# Altium project Control_Board.PrjPcb
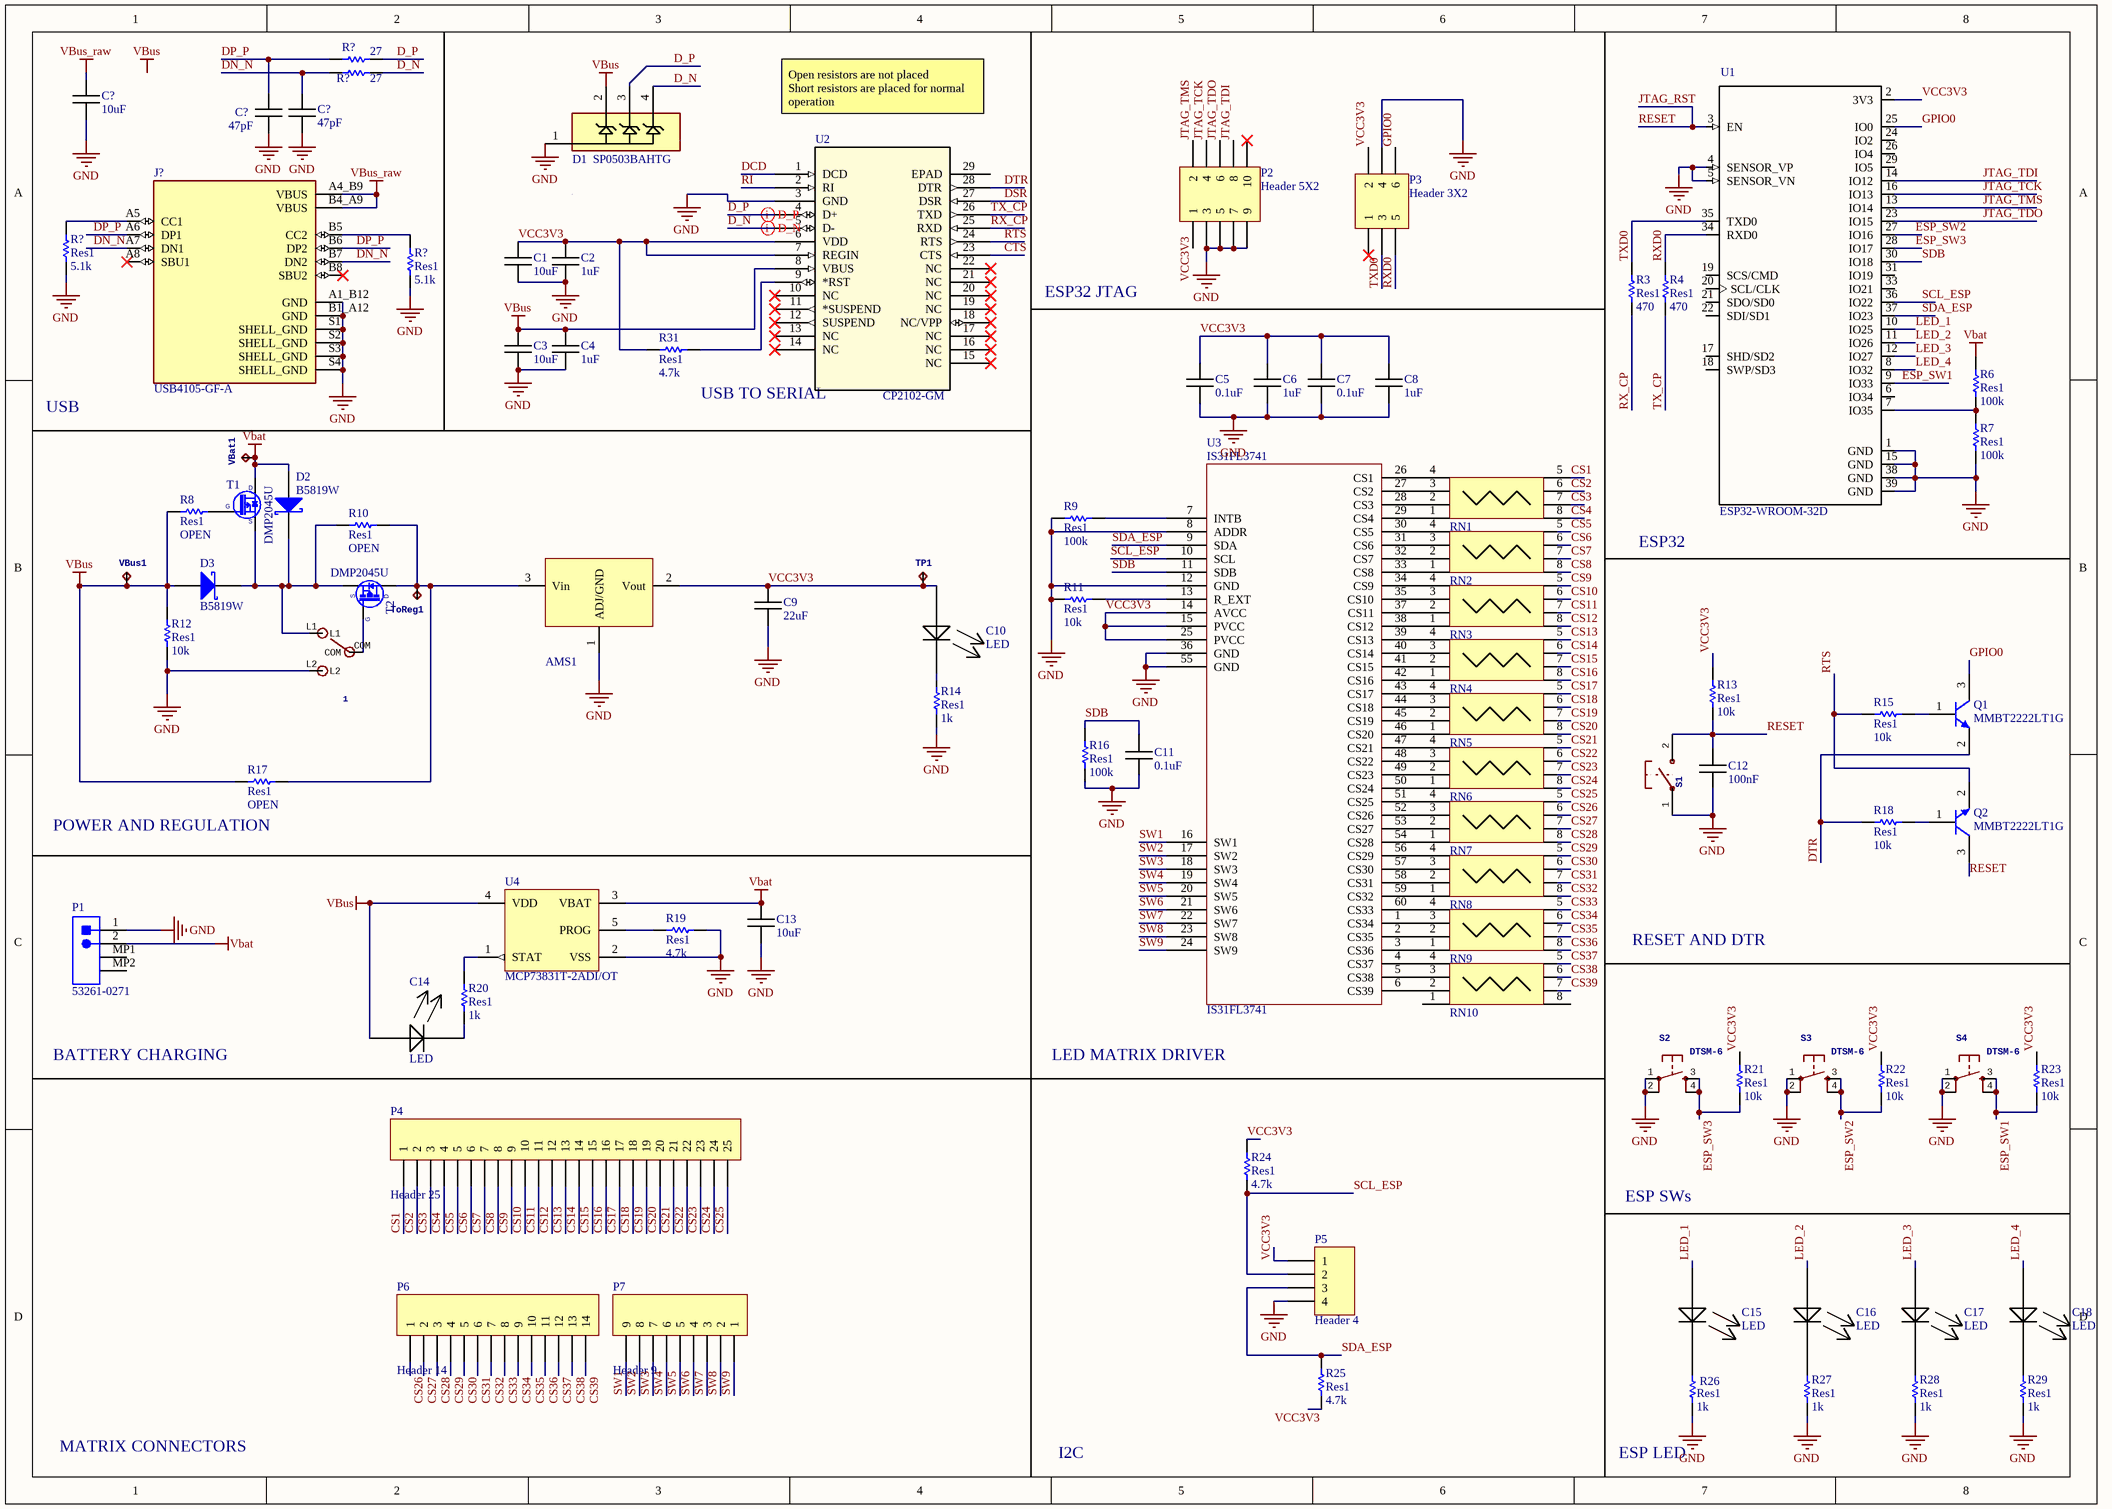
[diagram p0: Sheet2.SchDoc]
1 sheet, 91 parts. Net scope: global (net labels, ports and power ports of the same name join across sheets).
Board files: Control_Board.PcbDoc, PCB2.PcbDoc

## Sheet Sheet2.SchDoc
size A3

### Parts
(Parts that share a designator on the sheet are numbered #1, #2 ... from top to bottom, then left to right.)
1  Footprint of the VIMEX MSK-12C02 SPDT SMD Switch Created by mzst on 17-Jan-2016  [MSK-12C02]  (value not drawn)
AMS1  AMS1117  [SOT-223-3]  (value not drawn)
C1  10uF  [C 0603 / 1608]
C2  1uF  [C 0603 / 1608]
C3  10uF  [C 0603 / 1608]
C4  1uF  [C 0603 / 1608]
C5  0.1uF  [C 0603 / 1608]
C6  1uF  [C 0603 / 1608]
C7  0.1uF  [C 0603 / 1608]
C8  1uF  [C 0603 / 1608]
C9  22uF  [C 0603 / 1608]
C10  LED  [LED 0603(2)]
C11  0.1uF  [C 0603 / 1608]
C12  100nF  [C 0603 / 1608]
C13  10uF  [C 0603 / 1608]
C14  LED  [LED 0603(2)]
C15  LED  [LED 0603(2)]
C16  LED  [LED 0603(2)]
C17  LED  [LED 0603(2)]
C18  LED  [LED 0603(2)]
C?#1  10uF  [C 0603 / 1608]
C?#2  47pF  [C 0603 / 1608]
C?#3  47pF  [C 0603 / 1608]
D1  Part Number: SP0503BAHTG  [Littelfuse_SP0503BAHTG_0]  (hidden comment: Diode_Littelfuse_SP0503BAHTG_eec)
D2  B5819W  [MCC-SOD123_V]
D3  B5819W  [MCC-SOD123_V]
J?  USB4105-GF-A  [GCT_USB4105-GF-A]
P1  53261-0271  [MOLX-53261-0271_V]
P2  Header 5X2  [5x2_SidePCB]
P3  Header 3X2  [3x2_SidePCB]
P4  Header 25  [HDR1X25]
P5  Header 4  [HDR1X4]
P6  Header 14  [HDR1X14]
P7  Header 9  [HDR1X9]
Q1  MMBT2222LT1G  [ONSC-SOT-23-3-318-08_M]
Q2  MMBT2222LT1G  [ONSC-SOT-23-3-318-08_M]
R3  Res1  value 470  [C 0603 / 1608]
R4  Res1  value 470  [C 0603 / 1608]
R6  Res1  value 100k  [C 0603 / 1608]
R7  Res1  value 100k  [C 0603 / 1608]
R8  Res1  value OPEN  [C 0603 / 1608]
R9  Res1  value 100k  [C 0603 / 1608]
R10  Res1  value OPEN  [C 0603 / 1608]
R11  Res1  value 10k  [C 0603 / 1608]
R12  Res1  value 10k  [C 0603 / 1608]
R13  Res1  value 10k  [C 0603 / 1608]
R14  Res1  value 1k  [C 0603 / 1608]
R15  Res1  value 10k  [C 0603 / 1608]
R16  Res1  value 100k  [C 0603 / 1608]
R17  Res1  value OPEN  [C 0603 / 1608]
R18  Res1  value 10k  [C 0603 / 1608]
R19  Res1  value 4.7k  [C 0603 / 1608]
R20  Res1  value 1k  [C 0603 / 1608]
R21  Res1  value 10k  [C 0603 / 1608]
R22  Res1  value 10k  [C 0603 / 1608]
R23  Res1  value 10k  [C 0603 / 1608]
R24  Res1  value 4.7k  [C 0603 / 1608]
R25  Res1  value 4.7k  [C 0603 / 1608]
R26  Res1  value 1k  [C 0603 / 1608]
R27  Res1  value 1k  [C 0603 / 1608]
R28  Res1  value 1k  [C 0603 / 1608]
R29  Res1  value 1k  [C 0603 / 1608]
R31  Res1  value 4.7k  [C 0603 / 1608]
R?#1  value 27  [C 0603 / 1608]  (hidden comment: Res1)
R?#2  value 27  [C 0603 / 1608]  (hidden comment: Res1)
R?#3  Res1  value 5.1k  [C 0603 / 1608]
R?#4  Res1  value 5.1k  [C 0603 / 1608]
RN1  742C083121JP  [RESARRAY(4x0603)]  (value not drawn)
RN2  742C083121JP  [RESARRAY(4x0603)]  (value not drawn)
RN3  742C083121JP  [RESARRAY(4x0603)]  (value not drawn)
RN4  742C083121JP  [RESARRAY(4x0603)]  (value not drawn)
RN5  742C083121JP  [RESARRAY(4x0603)]  (value not drawn)
RN6  742C083121JP  [RESARRAY(4x0603)]  (value not drawn)
RN7  742C083121JP  [RESARRAY(4x0603)]  (value not drawn)
RN8  742C083121JP  [RESARRAY(4x0603)]  (value not drawn)
RN9  742C083121JP  [RESARRAY(4x0603)]  (value not drawn)
RN10  742C083121JP  [RESARRAY(4x0603)]  (value not drawn)
S1  Switch  [PUSH_SMD_3x4]  (value not drawn)
S2  DTSM-6  [DTSM-6]
S3  DTSM-6  [DTSM-6]
S4  DTSM-6  [DTSM-6]
T1  DMP2045U  [SOT95P237X112-3N]
T2  DMP2045U  [SOT95P237X112-3N]
ToReg1  Test pad  [TP20R]  (value not drawn)
TP1  Test pad  [TP20R]  (value not drawn)
U1  ESP32-WROOM-32D  [MODULE_ESP32-WROOM-32D]
U2  CP2102-GM  [QFN28_5X5]
U3  IS31FL3741  [QFN40P700X700X80-61N]
U4  MCP73831T-2ADI/OT  [SOT-23-OT5_M]
VBat1  Test pad  [TP20R]  (value not drawn)
VBus1  Test pad  [TP20R]  (value not drawn)

### Nets
GND: 1.L2 AMS1.1(ADJ/GND) C1.1 C2.1 C3.1 C4.1 C5.1 C6.1 C7.1 C8.1 C9.1 C11.2 C12.2 C13.1 C?#1.1 C?#2.1 C?#3.1 D1.1(COMMON_ANODE) J?.A1_B12(GND) J?.B1_A12(GND) J?.S1(SHELL_GND) J?.S2(SHELL_GND) J?.S3(SHELL_GND) J?.S4(SHELL_GND) P1.1 P2.3 P2.5 P2.7 P2.9 P3.4 P5.4 R7.1 R9.1 R11.1 R12.2 R14.2 R16.1 R19.1 R26.2 R27.2 R28.2 R29.2 R?#3.1 R?#4.1 S1.1(P$1) S2.1 S2.2 S3.1 S3.2 S4.1 S4.2 U1.1(GND) U1.4(SENSOR_VP) U1.5(SENSOR_VN) U1.15(GND) U1.38(GND) U1.39(GND) U2.3(GND) U3.8(ADDR) U3.12(GND) U3.36(GND) U3.55(GND) U4.2(VSS)
Vbat: C13.2 D2.1(A) P1.2 R6.2 T1.3(D) U4.3(VBAT) VBat1.TP
VBus: C3.2 C4.2 C14.1(+) D1.2(1_CATHODE) D3.1(A) R8.1 R12.1 R17.1 U2.8(VBUS) U4.4(VDD) VBus1.TP
VBus_raw: C?#1.2 J?.A4_B9(VBUS) J?.B4_A9(VBUS)
CS1: P4.1 RN1.5
CS2: P4.2 RN1.6
CS3: P4.3 RN1.7
CS4: P4.4 RN1.8
CS5: P4.5 RN2.5
CS6: P4.6 RN2.6
CS7: P4.7 RN2.7
CS8: P4.8 RN2.8
CS9: P4.9 RN3.5
CS10: P4.10 RN3.6
CS11: P4.11 RN3.7
CS12: P4.12 RN3.8
CS13: P4.13 RN4.5
CS14: P4.14 RN4.6
CS15: P4.15 RN4.7
CS16: P4.16 RN4.8
CS17: P4.17 RN5.5
CS18: P4.18 RN5.6
CS19: P4.19 RN5.7
CS20: P4.20 RN5.8
CS21: P4.21 RN6.5
CS22: P4.22 RN6.6
CS23: P4.23 RN6.7
CS24: P4.24 RN6.8
CS25: P4.25 RN7.5
CS26: P6.1 RN7.6
CS27: P6.2 RN7.7
CS28: P6.3 RN7.8
CS29: P6.4 RN8.5
CS30: P6.5 RN8.6
CS31: P6.6 RN8.7
CS32: P6.7 RN8.8
CS33: P6.8 RN9.5
CS34: P6.9 RN9.6
CS35: P6.10 RN9.7
CS36: P6.11 RN9.8
CS37: P6.12 RN10.5
CS38: P6.13 RN10.6
CS39: P6.14 RN10.7
CTS: U2.23(CTS)
D_N: D1.4(3_CATHODE) R?#2.1 U2.5(D-)
D_P: D1.3(2_CATHODE) R?#1.1 U2.4(D+)
DCD: U2.1(DCD)
DN_N: C?#3.2 J?.A7(DN1) J?.B7(DN2) R?#2.2
DP_P: C?#2.2 J?.A6(DP1) J?.B6(DP2) R?#1.2
DSR: U2.27(DSR)
DTR: Q1.2(E) R18.1 U2.28(DTR)
ESP_SW1: R23.1 S4.3 S4.4 U1.9(IO33)
ESP_SW2: R22.1 S3.3 S3.4 U1.27(IO16)
ESP_SW3: R21.1 S2.3 S2.4 U1.28(IO17)
GPIO0: P3.6 Q1.3(C) U1.25(IO0)
JTAG_RST: C12.1 Q2.3(C) R13.2 S1.2(P$2) U1.3(EN)  [also labelled RESET]
JTAG_TCK: P2.4 U1.16(IO13)
JTAG_TDI: P2.8 U1.14(IO12)
JTAG_TDO: P2.6 U1.23(IO15)
JTAG_TMS: P2.2 U1.13(IO14)
LED_1: C15.1(+) U1.10(IO25)
LED_2: C16.1(+) U1.11(IO26)
LED_3: C17.1(+) U1.12(IO27)
LED_4: C18.1(+) U1.8(IO32)
RI: U2.2(RI)
RTS: Q2.2(E) R15.1 U2.24(RTS)
RX_CP: R3.1 U2.25(RXD)
RXD0: P3.5 R4.2 U1.34(RXD0)
SCL_ESP: P5.2 R24.2 U1.36(IO22) U3.10(SCL)
SDA_ESP: P5.3 R25.2 U1.37(IO23) U3.9(SDA)
SDB: C11.1 R16.2 U1.30(IO18) U3.11(SDB)
SW1: P7.9 U3.16(SW1)
SW2: P7.8 U3.17(SW2)
SW3: P7.7 U3.18(SW3)
SW4: P7.6 U3.19(SW4)
SW5: P7.5 U3.20(SW5)
SW6: P7.4 U3.21(SW6)
SW7: P7.3 U3.22(SW7)
SW8: P7.2 U3.23(SW8)
SW9: P7.1 U3.24(SW9)
TX_CP: R4.1 U2.26(TXD)
TXD0: P3.3 R3.2 U1.35(TXD0)
VCC3V3: AMS1.2(Vout) C1.2 C2.2 C5.2 C6.2 C7.2 C8.2 C9.2 C10.1(+) P3.2 P5.1 R13.1 R21.2 R22.2 R23.2 R24.1 R25.1 R31.1 TP1.TP U1.2(3V3) U2.6(VDD) U2.7(REGIN) U3.14(AVCC) U3.15(PVCC) U3.25(PVCC)
Net1_COM: 1.COM T2.1(G)
Net1_L1: 1.L1 D2.2(K) D3.2(K) R10.1 T1.2(S) T2.2(S)
NetAMS1_3: AMS1.3(Vin) R10.2 R17.2 T2.3(D) ToReg1.TP
NetC10_2: C10.2(-) R14.1
NetC14_2: C14.2(-) R20.2
NetC15_2: C15.2(-) R26.1
NetC16_2: C16.2(-) R27.1
NetC17_2: C17.2(-) R28.1
NetC18_2: C18.2(-) R29.1
NetJ?_A5: J?.A5(CC1) R?#3.2
NetJ?_B5: J?.B5(CC2) R?#4.2
NetQ1_1: Q1.1(B) R15.2
NetQ2_1: Q2.1(B) R18.2
NetR6_1: R6.1 R7.2 U1.7(IO35)
NetR8_2: R8.2 T1.1(G)
NetR9_2: R9.2 U3.7(INTB)
NetR11_2: R11.2 U3.13(R_EXT)
NetR19_2: R19.2 U4.5(PROG)
NetR20_1: R20.1 U4.1(STAT)
NetR31_2: R31.2 U2.9(*RST)
NetRN1_1: RN1.1 U3.29(CS4)
NetRN1_2: RN1.2 U3.28(CS3)
NetRN1_3: RN1.3 U3.27(CS2)
NetRN1_4: RN1.4 U3.26(CS1)
NetRN2_1: RN2.1 U3.33(CS8)
NetRN2_2: RN2.2 U3.32(CS7)
NetRN2_3: RN2.3 U3.31(CS6)
NetRN2_4: RN2.4 U3.30(CS5)
NetRN3_1: RN3.1 U3.38(CS12)
NetRN3_2: RN3.2 U3.37(CS11)
NetRN3_3: RN3.3 U3.35(CS10)
NetRN3_4: RN3.4 U3.34(CS9)
NetRN4_1: RN4.1 U3.42(CS16)
NetRN4_2: RN4.2 U3.41(CS15)
NetRN4_3: RN4.3 U3.40(CS14)
NetRN4_4: RN4.4 U3.39(CS13)
NetRN5_1: RN5.1 U3.46(CS20)
NetRN5_2: RN5.2 U3.45(CS19)
NetRN5_3: RN5.3 U3.44(CS18)
NetRN5_4: RN5.4 U3.43(CS17)
NetRN6_1: RN6.1 U3.50(CS24)
NetRN6_2: RN6.2 U3.49(CS23)
NetRN6_3: RN6.3 U3.48(CS22)
NetRN6_4: RN6.4 U3.47(CS21)
NetRN7_1: RN7.1 U3.54(CS28)
NetRN7_2: RN7.2 U3.53(CS27)
NetRN7_3: RN7.3 U3.52(CS26)
NetRN7_4: RN7.4 U3.51(CS25)
NetRN8_1: RN8.1 U3.59(CS32)
NetRN8_2: RN8.2 U3.58(CS31)
NetRN8_3: RN8.3 U3.57(CS30)
NetRN8_4: RN8.4 U3.56(CS29)
NetRN9_1: RN9.1 U3.3(CS36)
NetRN9_2: RN9.2 U3.2(CS35)
NetRN9_3: RN9.3 U3.1(CS34)
NetRN9_4: RN9.4 U3.60(CS33)
NetRN10_2: RN10.2 U3.6(CS39)
NetRN10_3: RN10.3 U3.5(CS38)
NetRN10_4: RN10.4 U3.4(CS37)

Not connected (* = marked no-connect by the designer): J? A8(SBU1)* B8(SBU2)*; P1 MP1 MP2; P2 1 10*; P3 1*; RN10 1 8; U1 6(IO34) 17(SHD/SD2) 18(SWP/SD3) 19(SCS/CMD) 20(SCL/CLK) 21(SDO/SD0) 22(SDI/SD1) 24(IO2) 26(IO4) 29(IO5) 31(IO19) 33(IO21); U2 10(NC)* 11(*SUSPEND)* 12(SUSPEND)* 13(NC)* 14(NC)* 15(NC)* 16(NC)* 17(NC)* 18(NC/VPP)* 19(NC)* 20(NC)* 21(NC)* 22(NC)* 29(EPAD)

### Layout directives
differential pair: D_N, D_P

### Notes on the sheet
- Open resistors are not placed
  Short resistors are placed for normal operation
- ESP32 JTAG
- USB
- (near U2) USB TO SERIAL
- ESP32
- (near R17) POWER AND REGULATION
- RESET AND DTR
- BATTERY CHARGING
- LED MATRIX DRIVER
- ESP SWs
- MATRIX CONNECTORS
- I2C
- (near R26) ESP LED
- Labels drawn without touching a wire or pin: VBus, VCC3V3

### Library data of the parts
1 = MSK-12C02_SMD_SPDT_SWITCH
AMS1 = AMS1117: LDO 3.3V/5V/12V
C1-C9 C11-C13 C?#1-C?#3 = Capacitor
D1 = Diode_Littelfuse_SP0503BAHTG_eec: DIODE TVS DIODE 5.5VWM 8.5VC SOT143; helpURL: https://upverter.com/upn/revision/6b5b591e3bf31c16/; ComponentLink2Description: Datasheet; Temperature: -40°C to +85°C; Package: SOT143-4; Supplier 2: Mouser; Price: 0.571399033067; Supplier 1: Digi-Key; ComponentLink1URL: https://upverter.com/upn/revision/6b5b591e3bf31c16/; Supplier Part Number 2: 576-SP0503BAHTG; Supplier Part Number 1: F2715CT-ND; Manufacturer: Littelfuse; ComponentLink1Description: Upverter; ComponentLink2URL: http://www.littelfuse.com/~/media/electronics/datasheets/tvs_diode_arrays/littelfuse_tvs_diode_array_sp05_datasheet.pdf.pdf; RoHS: TRUE; Mouser Part Number: 576-SP0503BAHTG; Temperature Range High: +85°C; Digikey Description: DIODE TVS DIODE 5.5VWM 8.5VC SOT143; Digikey Part Number: F2715CT-ND; Lead Free: yes; Temperature Range Low: -40°C
D2 D3 = CMP-2100-03587-1: Schottky Barrier Rectifier, 1 A, 40 Vrm, -65 to 125 degC, 2-Pin SOD123, RoHS, Tape and Reel; Manufacturer: Micro Commercial Components; Package Description: 2-Pin Small Outline Diode, Body 2.7 x 1.6 mm, Height 1.35 mm; Datasheet URL: http://www.mccsemi.com/up_pdf/B5817W-B5819W(SOD-123).pdf; Manufacturer URL: http://www.mccsemi.com/; Package Reference: SOD123; Package URL: http://www.mccsemi.com/up_pdf/1N4448W(SOD-123).pdf; Datasheet Version: Rev. B, 01/2013
J? = USB4105-GF-A: USB-C (USB TYPE-C) USB 2.0 Receptacle Connector 24 (16+8 Dummy) Position Surface Mount, Right Angle; Through Hole; MF: GCT; Price: None; Value: *; MP: USB4105-GF-A; Package: None; Purchase-URL: https://pricing.snapeda.com/search/part/USB4105-GF-A/?ref=eda; SnapEDA_Link: https://www.snapeda.com/parts/USB4105-GF-A/Global%20Connector%20Technology/view-part/4423780/?ref=snap; Check_prices: https://www.snapeda.com/parts/USB4105-GF-A/Global%20Connector%20Technology/view-part/4423780/?ref=eda; Availability: Warning
P1 = CMP-2000-05633-1: PicoBlade(TM) Header, Right Angle, -40 to 85 degC, 2-Pin SMD, RoHS, Tape and Reel; Current - Max: 1A; Brand: Molex; Voltage Rating: 125V; Number of Positions: 2; Pitch: 1.25mm; Package Version: Rev. H, 11/2014; Factory Pack Quantity: 1000; Datasheet URL: http://www.molex.com/webdocs/datasheets/pdf/en-us/0532610271_PCB_HEADERS.pdf; Datasheet Version: 03/2016; Housing Material: Thermoplastic; RoHS: Details; Product Type: Headers; Number of Rows: 1; Termination Style: SMD; Mounting Technology: SurfaceMount; Number of Positions / Contacts: 2; Package URL: http://www.molex.com/pdm_docs/sd/532610271_sd.pdf; Mounting Angle: Right; Mounting Style: SMD/SMT; Manufacturer: Molex; Product Category: 1.25mmConnectors; Tradename: PicoBlade; Voltage - Max: 125V; Manufacturer URL: http://www.molex.com/; Series: 53261; Package Description: 2-Leads Header, Pitch 1.25 mm, Mated Height 3.4 mm; Package Reference: 53261-0271; Current Rating: 1A; Contact Plating: Tin; Contact Material: PhosphorBronze; Type: Shrouded; Packaging: Reel
P2 = Header 5X2: Header, 5-Pin, Dual row; LatestRevisionDate: 17-Jul-2002; LatestRevisionNote: Re-released for DXP Platform.; Publisher: Altium Limited
P3 = Header 3X2: Header, 3-Pin, Dual row; LatestRevisionDate: 17-Jul-2002; LatestRevisionNote: Re-released for DXP Platform.; Publisher: Altium Limited
P4 = Header 25: Header, 25-Pin; LatestRevisionDate: 17-Jul-2002; LatestRevisionNote: Re-released for DXP Platform.; Publisher: Altium Limited
P5 = Header 4: Header, 4-Pin; LatestRevisionDate: 17-Jul-2002; LatestRevisionNote: Re-released for DXP Platform.; Publisher: Altium Limited
P6 = Header 14: Header, 14-Pin; LatestRevisionDate: 17-Jul-2002; LatestRevisionNote: Re-released for DXP Platform.; Publisher: Altium Limited
P7 = Header 9: Header, 9-Pin; LatestRevisionDate: 17-Jul-2002; LatestRevisionNote: Re-released for DXP Platform.; Publisher: Altium Limited
Q1 Q2 = CMP-0722-00001-1: General Purpose Transistor, NPN, 0.6 A IC Continuous, 3-Pin SOT23, RoHS, Tape and Reel; Manufacturer: ON Semiconductor; PTM Max.: 0.225 W; HFE Max.: 300; HFE Min.: 100; V(BR) CEO: 30 V Min.; FT: 250 MHz; IC Continuous: 0.6 A; RoHS: TRUE; DatasheetVersion: Rev. 10; PackageVersion: Rev. AP; Polarity: NPN; PackageReference: SOT-23-3; PackageDescription: 3-Pin SOT23, Body 2.9 x 1.3 mm, Pitch 0.95 mm; ComponentLink1URL: http://www.onsemi.com/; ComponentLink2URL: http://www.onsemi.com/pub_link/Collateral/MMBT2222LT1-D.PDF; PartNumber: MMBT2222LT1G; ComponentLink3URL: http://www.onsemi.com/pub_link/Collateral/MMBT2222LT1-D.PDF; Mounting Technology: Surface Mount; ComponentLink3Description: Package Specification; ComponentLink1Description: Manufacturer URL; Packing: Tape and Reel; ComponentLink2Description: Datasheet
R3 R4 R6-R29 R31 R?#1-R?#4 = Res1: Resistor; Published: 8-Jun-2000; LatestRevisionDate: 17-Jul-2002; LatestRevisionNote: Re-released for DXP Platform.; PackageReference: AXIAL-0.3; Publisher: Altium Limited; PackageDescription: Axial Device, Thru-Hole; 2 Leads; 0.3 in Pin Spacing
RN1-RN10 = Resistor Array 4x: Res Thick Film Array 120 Ohm 5% 1/4W Â±200ppm/Â°C ISOL Molded 8-Pin 1206_4 X 0603_ Concave SMD Paper T/R; MF: CTS Resistor; Availability: Unavailable; SnapEDA_Link: https://www.snapeda.com/parts/742C083121JP/CTS%20Resistor%20Products/view-part/?ref=snap; Price: None; Package: 1206 CTS Components; MP: 742C083121JP; Value: *
S1 = B3U-1000P: MANUFACTURER: Omron; DIGIKEY: SW1020CT-ND; MPN: B3U-1000P
T1 T2 = Si2333CDS-T1-GE3: P-CHANNEL MOSFET WITH DIODE; Part Description: -12V -5.1A P-Channel  TrenchFET® Power MOSFET; Manufacturer: VISHAY SILICONIX; PressFit: No; Bonding: No; Part Number: Si2333CDS-T1-GE3; Component Kind: Standard; Component Type: Standard; Device: Si2333CDS-T1-GE3; PackageDescription: SOT, 0.95mm, pitch; 3 pin,1.30mm W X 2.92mm L X 1.12mm H body, IPC Medium Density; Manufacturer Part Number: Si2333CDS-T1-GE3; Pin Count: 3; Case: SOT23-3; Mounted: Yes; Socket: No; SMD: Yes; Sense: No; ComponentHeight: 1.12mm; HelpURL: \\cern.ch\dfs\Applications\Altium\Datasheets\Si2333CDS-T1-GE3.pdf; Author: CERN DEM JLC; CreateDate: 03/03/2011; LatestRevisionDate: 02/05/2011
ToReg1 TP1 VBat1 VBus1 = TPTP20R
U1 = ESP32-WROOM-32D: IC: SoC; GPIO, I2C, I2S, IR, SD, SDIO, SPI, UART; 2.7Ã·3.6VDC; 20dBm; MF: Espressif Systems; Availability: Warning; SnapEDA_Link: https://www.snapeda.com/parts/ESP32-WROOM-32D/Espressif%20Systems/view-part/?ref=snap; MP: ESP32-WROOM-32D; Price: 3.98 USD; Package: Module Espressif Systems; Value: *
U2 = CP2102-GM: No Description Available; Vendor: Silicon Labs; Built_By: EMA_UL_Team; Manufacturer_Part_Number: CP2102-GM; Copyright: Copyright (C) 2018 Accelerated Designs. All rights reserved; RefDes: RefDes; Type: DEV; Value: Value
U4 = CMP-0133-00142-1: Miniature Single-Cell, Fully Integrated Li-Ion, Li-Polymer Charge Management Controller, 4.2V, 5-Pin SOT-23, Industrial Temperature, Tape and Reel; PackageVersion: revBB, Aug-2009; DatasheetVersion: revE, Sep-2008; PackageDescription: 5-Lead Plastic Small Outline Transistor (OT) [SOT-23]; PackageReference: SOT-23-OT5; Code_IPC: SOT23-5

## Assembly variants
Variant of Control_Board: all parts fitted